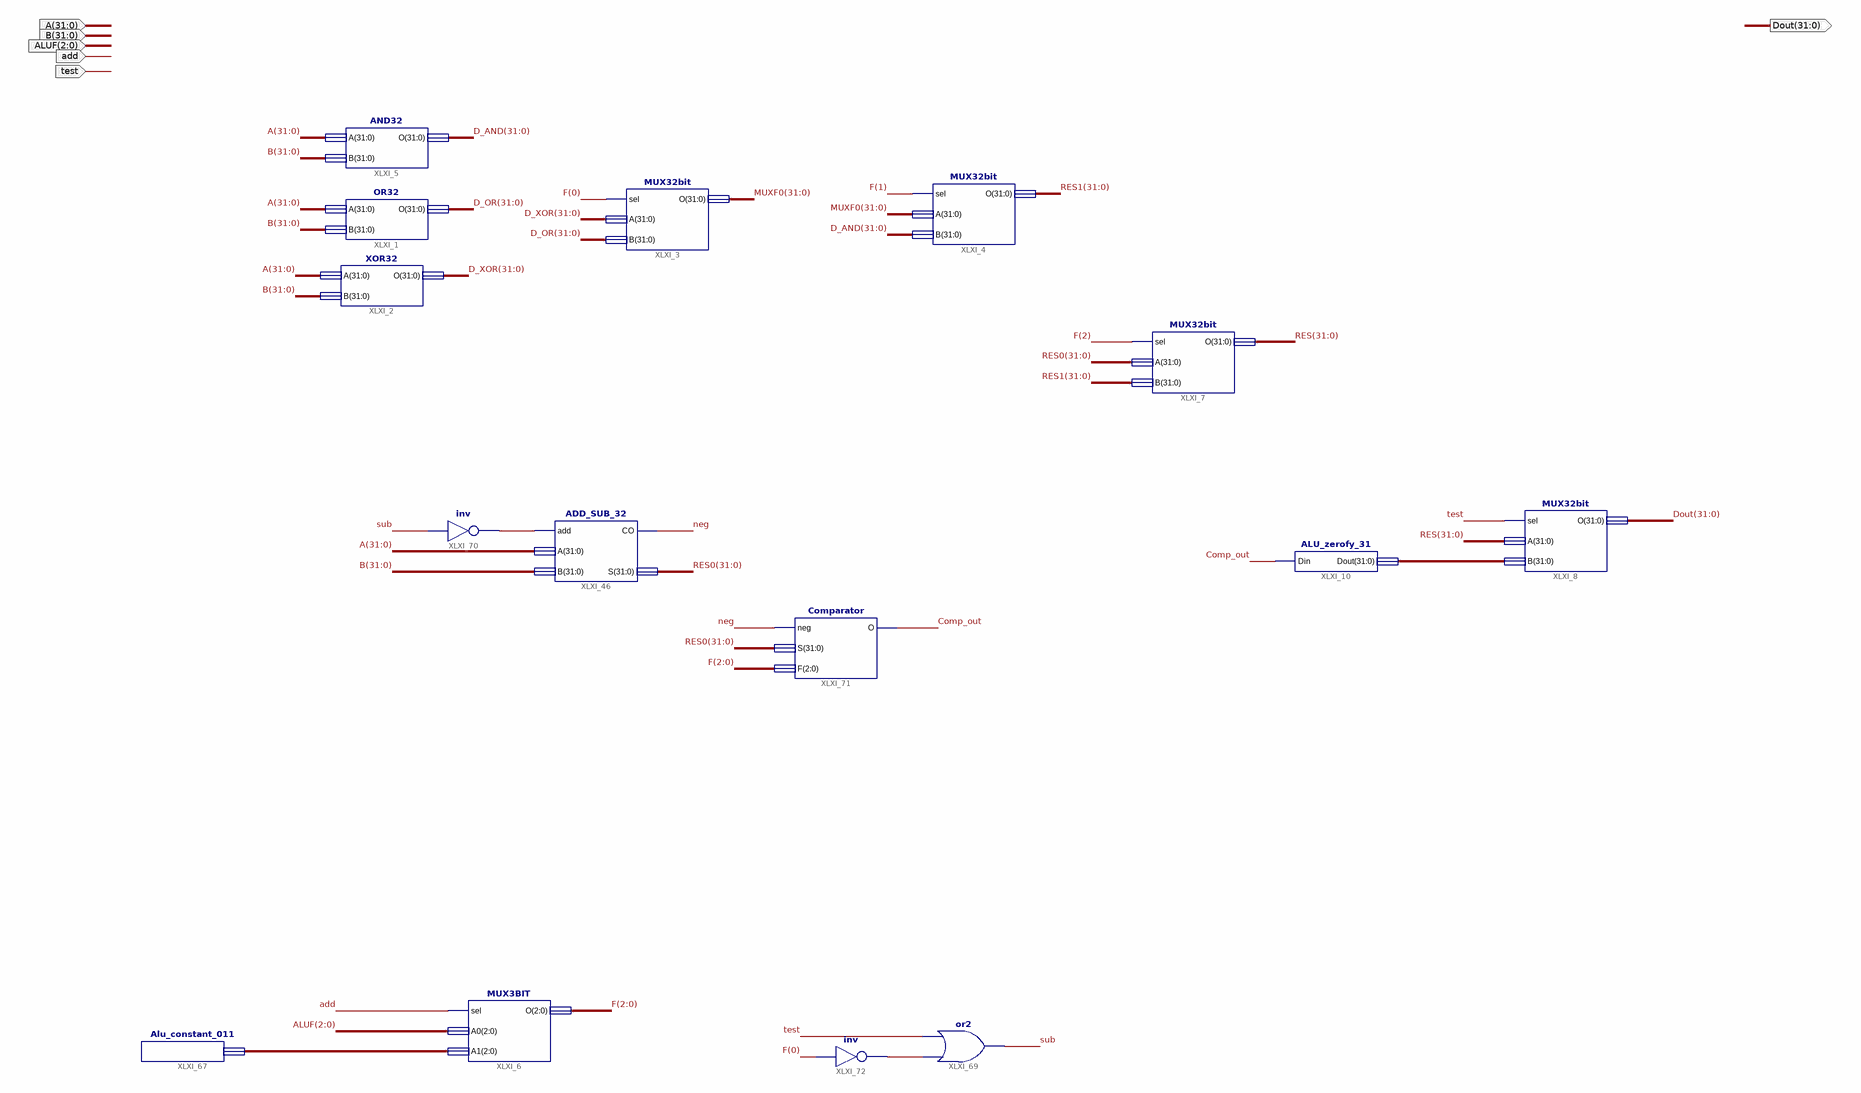
[diagram p0: schematic sheet 1]
// Xilinx ISE schematic ALU_Env.sch (spartan6) as structural Verilog: 15 symbols, 6 ports
module ALU_Env (
  input  [31:0] A,
  input  [31:0] B,
  input  test,
  input  add,
  input  [2:0] ALUF,
  output [31:0] Dout
);

  wire Comp_out, neg, sub, XLXN_215, XLXN_221;
  wire [2:0] F, XLXN_214;
  wire [31:0] D_AND, D_OR, D_XOR, MUXF0, RES, RES0, RES1, XLXN_141;

  AND32 XLXI_5 (.A(A), .B(B), .O(D_AND));
  OR32 XLXI_1 (.A(A), .B(B), .O(D_OR));
  XOR32 XLXI_2 (.A(A), .B(B), .O(D_XOR));
  ADD_SUB_32 XLXI_46 (.add(XLXN_215), .A(A), .B(B), .CO(neg), .S(RES0));
  MUX32bit XLXI_3 (.sel(F[0]), .A(D_XOR), .B(D_OR), .O(MUXF0));
  MUX32bit XLXI_4 (.sel(F[1]), .A(MUXF0), .B(D_AND), .O(RES1));
  MUX32bit XLXI_7 (.sel(F[2]), .A(RES0), .B(RES1), .O(RES));
  Alu_constant_011 XLXI_67 (.Dout(XLXN_214));
  MUX3BIT XLXI_6 (.sel(add), .A0(ALUF), .A1(XLXN_214), .O(F));
  not XLXI_70 (XLXN_215, sub);
  Comparator XLXI_71 (.neg(neg), .S(RES0), .F(F), .O(Comp_out));
  MUX32bit XLXI_8 (.sel(test), .A(RES), .B(XLXN_141), .O(Dout));
  ALU_zerofy_31 XLXI_10 (.Din(Comp_out), .Dout(XLXN_141));
  or XLXI_69 (sub, XLXN_221, test);
  not XLXI_72 (XLXN_221, F[0]);
endmodule
